# EAGLE schematic Mainboard (EAGLE 6.1)

## Sheet 1 of 5
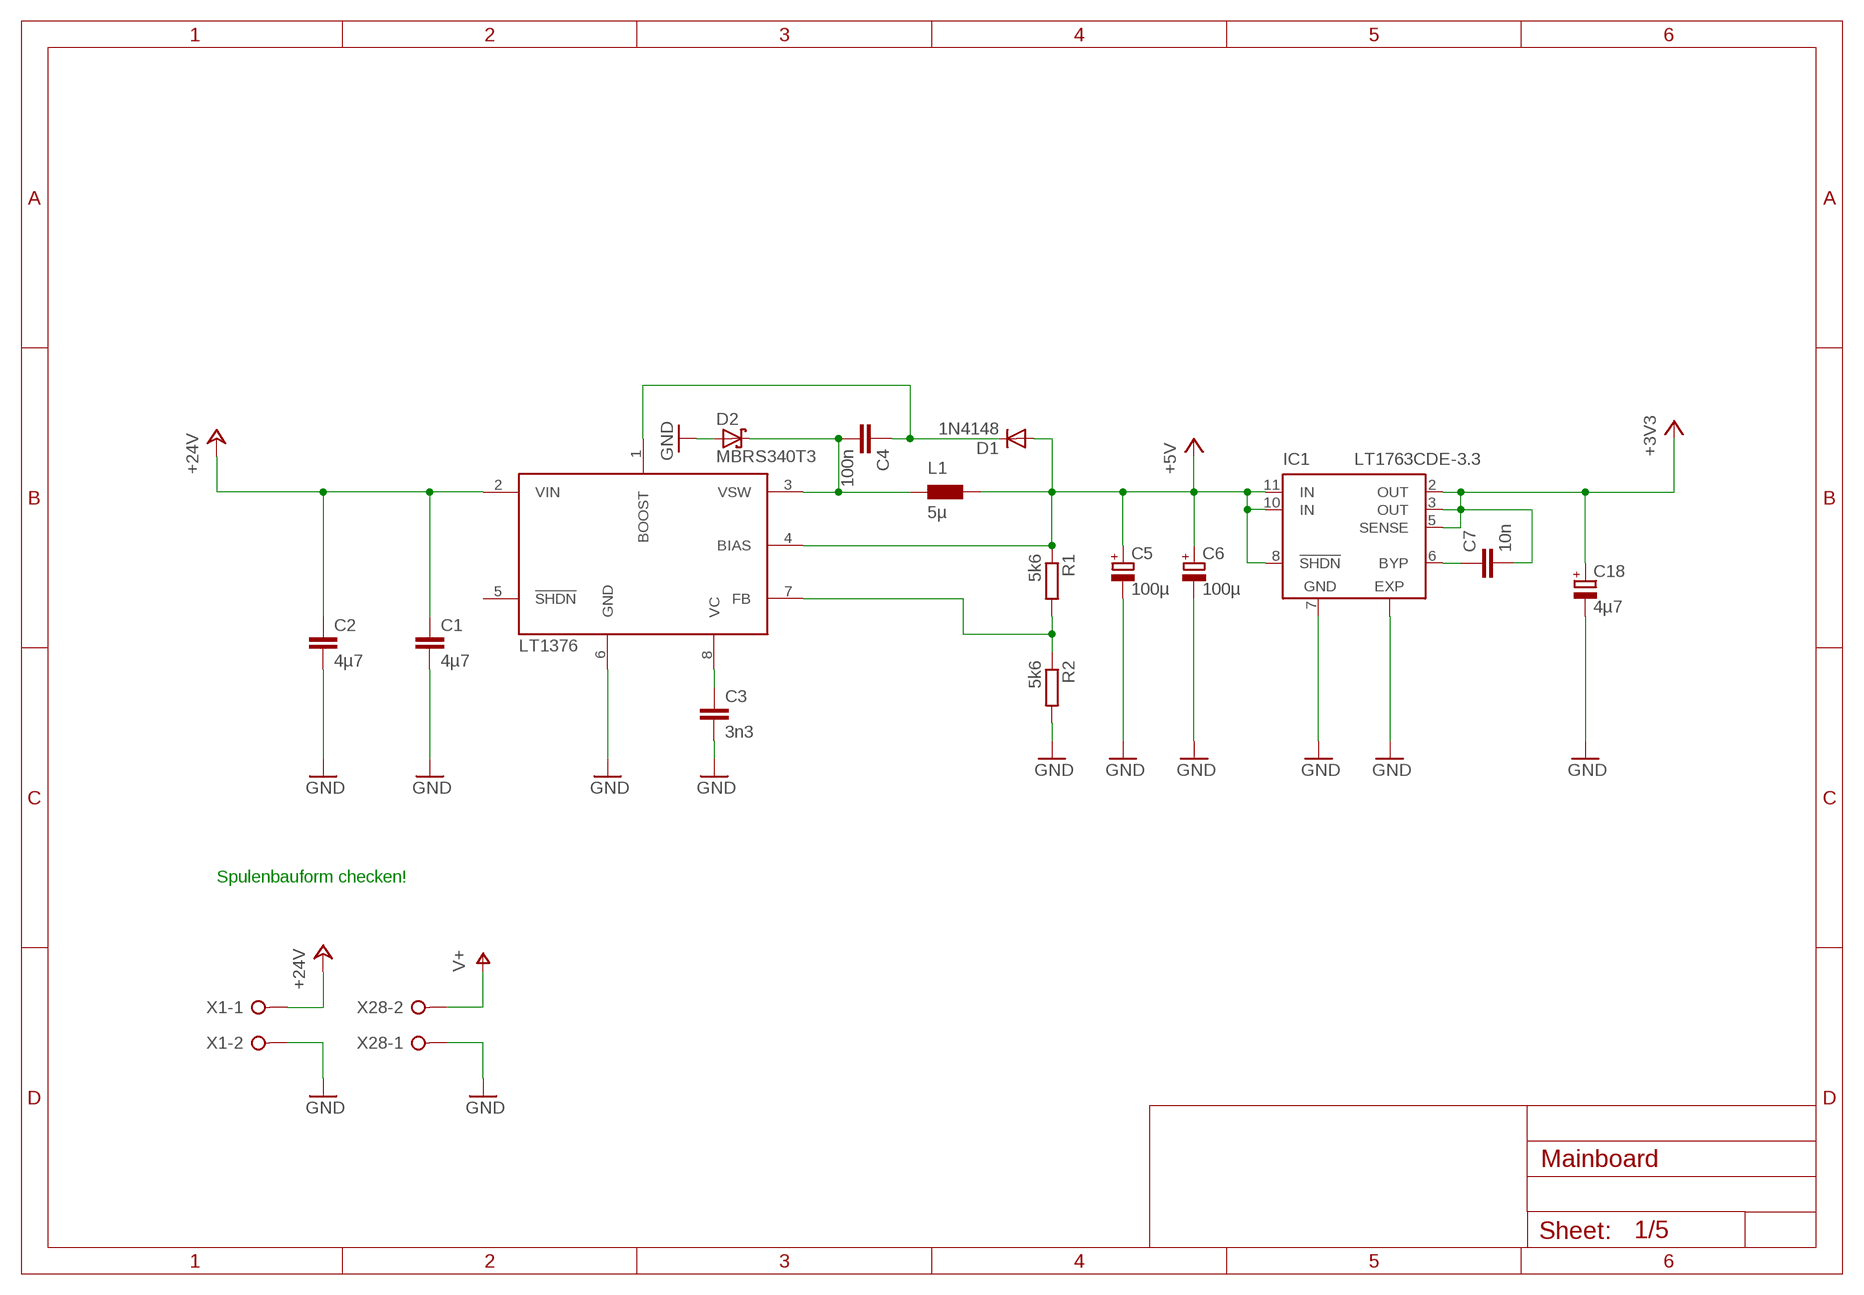
[diagram p0: schematic, sheet 1]

### Parts
C1  4µ7  C-EUC0805  [C0805]
C2  4µ7  C-EUC0805  [C0805]
C3  3n3  C-EUC0805  [C0805]
C4  100n  C-EUC0805  [C0805]
C5  100µ  CPOL-EUUD-6,3X7,7  [UD-6,3X7,7_NICHICON]
C6  100µ  CPOL-EUUD-6,3X7,7  [UD-6,3X7,7_NICHICON]
C7  10n  C-EUC0805  [C0805]
C18  4µ7  CPOL-EUUD-6,3X7,7  [UD-6,3X7,7_NICHICON]
D1  1N4148  DIODE-SOD123  [SOD123]
D2  MBRS340T3  [SMC]
IC1  LT1763CDE-3.3  [DFN12]
L1  5µ  PIS4720  [PIS4720]
R1  5k6  R-EU_R0805  [R0805]
R2  5k6  R-EU_R0805  [R0805]
U$1  LT1376  [SOIC8]
X1  W237-02P  [W237-132]
X28  W237-02P  [W237-132]

### Nets
+3V3: C7.2 C18.+ IC1.2(OUT) IC1.3(OUT) IC1.5(SENSE) ; also sheet 2,3,4,5
+5V: C5.+ C6.+ D1.A IC1.8(!SHDN) IC1.10(IN) IC1.11(IN) L1.P$2 R1.1 U$1.4(BIAS)
+24V: C1.1 C2.1 U$1.2(VIN) X1.1
GND: C1.2 C2.2 C3.2 C5.- C6.- C18.- D2.A IC1.7(GND) IC1.EXP R2.2 U$1.6(GND) X1.2 X28.1 ; also sheet 2,3,4,5
N$1: C3.1 U$1.8(VC)
N$2: C4.2 D2.C L1.P$1 U$1.3(VSW)
N$3: C4.1 D1.C U$1.1(BOOST)
N$7: R1.2 R2.1 U$1.7(FB)
N$8: C7.1 IC1.6(BYP)
V+: X28.2 ; also sheet 4
Unconnected: U$1.5(!SHDN)

### Notes on the sheet
- Spulenbauform checken!

## Sheet 2 of 5
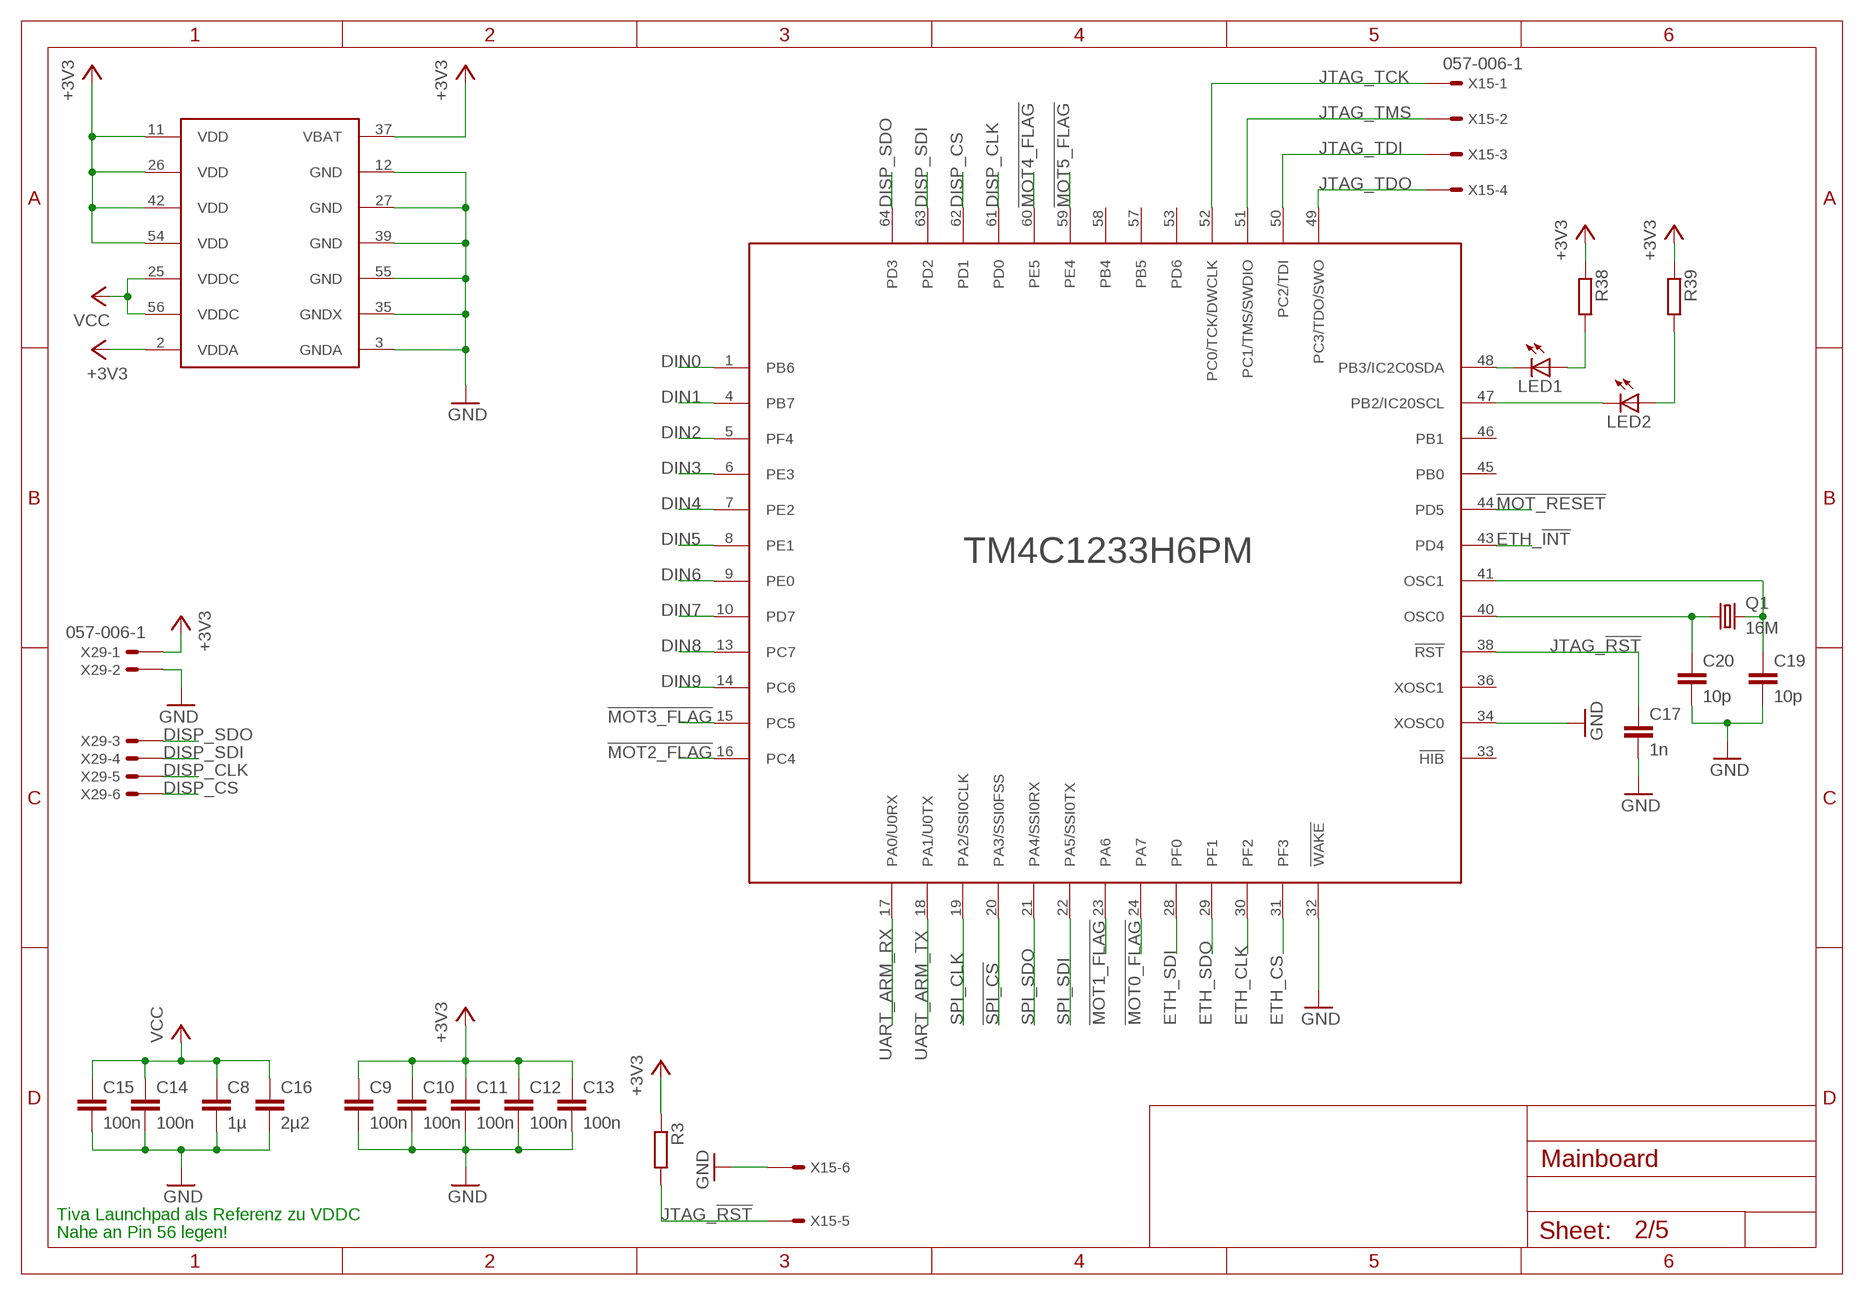
[diagram p1: schematic, sheet 2]

### Parts
C8  1µ  C-EUC0805  [C0805]
C9  100n  C-EUC0805  [C0805]
C10  100n  C-EUC0805  [C0805]
C11  100n  C-EUC0805  [C0805]
C12  100n  C-EUC0805  [C0805]
C13  100n  C-EUC0805  [C0805]
C14  100n  C-EUC0805  [C0805]
C15  100n  C-EUC0805  [C0805]
C16  2µ2  C-EUC0805  [C0805]
C17  1n  C-EUC0805  [C0805]
C19  10p  C-EUC0805  [C0805]
C20  10p  C-EUC0805  [C0805]
LED1  LEDSML0805  [SML0805]
LED2  LEDSML0805  [SML0805]
Q1  16M  CRYSTALSM49  [SM49]
R3  R-EU_R0805  [R0805]
R38  R-EU_R0805  [R0805]
R39  R-EU_R0805  [R0805]
U$2  TM4C1233H6PM  [QFP50P1200X1200X160-64N]
X15  057-006-1  [057-006-1]
X29  057-006-1  [057-006-1]

### Nets
!MOT0_FLAG: U$2.24(PA7) ; also sheet 4
!MOT1_FLAG: U$2.23(PA6) ; also sheet 4
!MOT2_FLAG: U$2.16(PC4) ; also sheet 4
!MOT3_FLAG: U$2.15(PC5) ; also sheet 4
!MOT4_FLAG: U$2.60(PE5) ; also sheet 4
!MOT5_FLAG: U$2.59(PE4) ; also sheet 4
!MOT_RESET: U$2.44(PD5) ; also sheet 4
!SPI_CS: U$2.20(PA3/SSI0FSS) ; also sheet 4
+3V3: C9.1 C10.1 C11.1 C12.1 C13.1 R3.1 R38.1 R39.1 U$2.2(VDDA) U$2.11(VDD) U$2.26(VDD) U$2.37(VBAT) U$2.42(VDD) U$2.54(VDD) X29.1 ; also sheet 1,3,4,5
DIN0: U$2.1(PB6) ; also sheet 3
DIN1: U$2.4(PB7) ; also sheet 3
DIN2: U$2.5(PF4) ; also sheet 3
DIN3: U$2.6(PE3) ; also sheet 3
DIN4: U$2.7(PE2) ; also sheet 3
DIN5: U$2.8(PE1) ; also sheet 3
DIN6: U$2.9(PE0) ; also sheet 3
DIN7: U$2.10(PD7) ; also sheet 3
DIN8: U$2.13(PC7) ; also sheet 3
DIN9: U$2.14(PC6) ; also sheet 3
DISP_CLK: U$2.61(PD0) X29.5
DISP_CS: U$2.62(PD1) X29.6
DISP_SDI: U$2.63(PD2) X29.4
DISP_SDO: U$2.64(PD3) X29.3
ETH_!INT: U$2.43(PD4) ; also sheet 5
ETH_CLK: U$2.30(PF2) ; also sheet 5
ETH_CS: U$2.31(PF3) ; also sheet 5
ETH_SDI: U$2.28(PF0) ; also sheet 5
ETH_SDO: U$2.29(PF1) ; also sheet 5
GND: C8.2 C9.2 C10.2 C11.2 C12.2 C13.2 C14.2 C15.2 C16.2 C17.2 C19.2 C20.2 U$2.3(GNDA) U$2.12(GND) U$2.27(GND) U$2.32(!WAKE) U$2.34(XOSC0) U$2.35(GNDX) U$2.39(GND) U$2.55(GND) X15.6 X29.2 ; also sheet 1,3,4,5
JTAG_!RST: C17.1 R3.2 U$2.38(!RST) X15.5
JTAG_TCK: U$2.52(PC0/TCK/DWCLK) X15.1
JTAG_TDI: U$2.50(PC2/TDI) X15.3
JTAG_TDO: U$2.49(PC3/TDO/SWO) X15.4
JTAG_TMS: U$2.51(PC1/TMS/SWDIO) X15.2
N$4: LED1.C U$2.48(PB3/IC2C0SDA)
N$5: C19.1 Q1.2 U$2.41(OSC1)
N$6: C20.1 Q1.1 U$2.40(OSC0)
N$62: LED1.A R38.2
N$66: LED2.A R39.2
N$69: LED2.C U$2.47(PB2/IC20SCL)
SPI_CLK: U$2.19(PA2/SSI0CLK) ; also sheet 4
SPI_SDI: U$2.22(PA5/SSI0TX) ; also sheet 4
SPI_SDO: U$2.21(PA4/SSI0RX) ; also sheet 4
UART_ARM_RX: U$2.17(PA0/U0RX) ; also sheet 3
UART_ARM_TX: U$2.18(PA1/U0TX) ; also sheet 3
VCC: C8.1 C14.1 C15.1 C16.1 U$2.25(VDDC) U$2.56(VDDC)
Unconnected: U$2.33(!HIB) U$2.36(XOSC1) U$2.45(PB0) U$2.46(PB1) U$2.53(PD6) U$2.57(PB5) U$2.58(PB4)

### Notes on the sheet
- Tiva Launchpad als Referenz zu VDDC
- Nahe an Pin 56 legen!

## Sheet 3 of 5
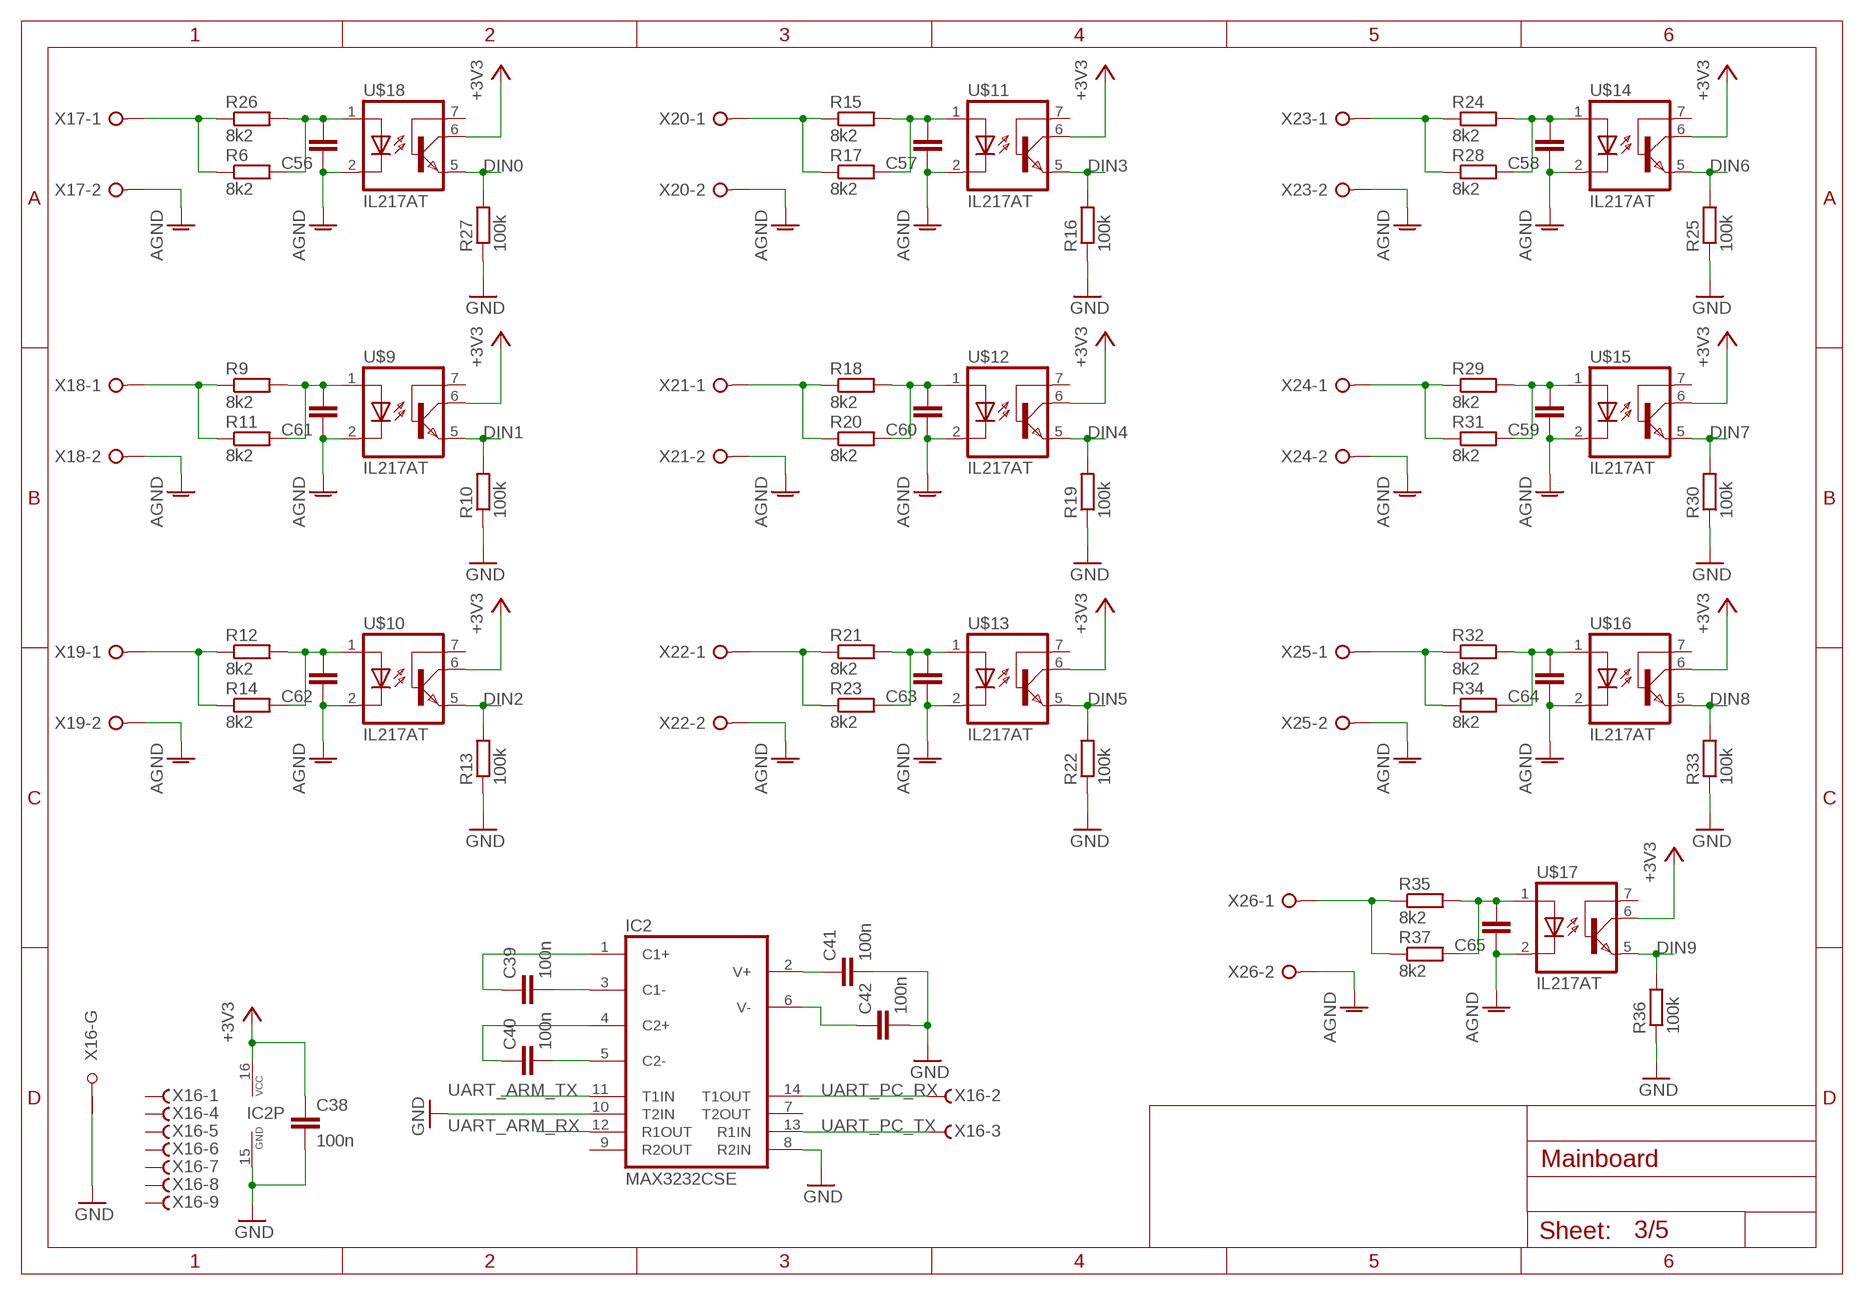
[diagram p2: schematic, sheet 3]

### Parts
C38  100n  C-EUC0805  [C0805]
C39  100n  C-EUC0805  [C0805]
C40  100n  C-EUC0805  [C0805]
C41  100n  C-EUC0805  [C0805]
C42  100n  C-EUC0805  [C0805]
C56  C-EUC1210  [C1210]
C57  C-EUC1210  [C1210]
C58  C-EUC1210  [C1210]
C59  C-EUC1210  [C1210]
C60  C-EUC1210  [C1210]
C61  C-EUC1210  [C1210]
C62  C-EUC1210  [C1210]
C63  C-EUC1210  [C1210]
C64  C-EUC1210  [C1210]
C65  C-EUC1210  [C1210]
IC2  MAX3232CSE  [SO16]
R6  8k2  R-EU_R0805  [R0805]
R9  8k2  R-EU_R0805  [R0805]
R10  100k  R-EU_R0805  [R0805]
R11  8k2  R-EU_R0805  [R0805]
R12  8k2  R-EU_R0805  [R0805]
R13  100k  R-EU_R0805  [R0805]
R14  8k2  R-EU_R0805  [R0805]
R15  8k2  R-EU_R0805  [R0805]
R16  100k  R-EU_R0805  [R0805]
R17  8k2  R-EU_R0805  [R0805]
R18  8k2  R-EU_R0805  [R0805]
R19  100k  R-EU_R0805  [R0805]
R20  8k2  R-EU_R0805  [R0805]
R21  8k2  R-EU_R0805  [R0805]
R22  100k  R-EU_R0805  [R0805]
R23  8k2  R-EU_R0805  [R0805]
R24  8k2  R-EU_R0805  [R0805]
R25  100k  R-EU_R0805  [R0805]
R26  8k2  R-EU_R0805  [R0805]
R27  100k  R-EU_R0805  [R0805]
R28  8k2  R-EU_R0805  [R0805]
R29  8k2  R-EU_R0805  [R0805]
R30  100k  R-EU_R0805  [R0805]
R31  8k2  R-EU_R0805  [R0805]
R32  8k2  R-EU_R0805  [R0805]
R33  100k  R-EU_R0805  [R0805]
R34  8k2  R-EU_R0805  [R0805]
R35  8k2  R-EU_R0805  [R0805]
R36  100k  R-EU_R0805  [R0805]
R37  8k2  R-EU_R0805  [R0805]
U$9  IL217AT  [SOIC8]
U$10  IL217AT  [SOIC8]
U$11  IL217AT  [SOIC8]
U$12  IL217AT  [SOIC8]
U$13  IL217AT  [SOIC8]
U$14  IL217AT  [SOIC8]
U$15  IL217AT  [SOIC8]
U$16  IL217AT  [SOIC8]
U$17  IL217AT  [SOIC8]
U$18  IL217AT  [SOIC8]
X16  F09HPS  [F09HP]
X17  W237-02P  [W237-132]
X18  W237-02P  [W237-132]
X19  W237-02P  [W237-132]
X20  W237-02P  [W237-132]
X21  W237-02P  [W237-132]
X22  W237-02P  [W237-132]
X23  W237-02P  [W237-132]
X24  W237-02P  [W237-132]
X25  W237-02P  [W237-132]
X26  W237-02P  [W237-132]

### Nets
+3V3: C38.1 IC2.16(VCC) U$9.6(COL) U$10.6(COL) U$11.6(COL) U$12.6(COL) U$13.6(COL) U$14.6(COL) U$15.6(COL) U$16.6(COL) U$17.6(COL) U$18.6(COL) ; also sheet 1,2,4,5
DIN0: R27.2 U$18.5(EMI) ; also sheet 2
DIN1: R10.2 U$9.5(EMI) ; also sheet 2
DIN2: R13.2 U$10.5(EMI) ; also sheet 2
DIN3: R16.2 U$11.5(EMI) ; also sheet 2
DIN4: R19.2 U$12.5(EMI) ; also sheet 2
DIN5: R22.2 U$13.5(EMI) ; also sheet 2
DIN6: R25.2 U$14.5(EMI) ; also sheet 2
DIN7: R30.2 U$15.5(EMI) ; also sheet 2
DIN8: R33.2 U$16.5(EMI) ; also sheet 2
DIN9: R36.2 U$17.5(EMI) ; also sheet 2
GND: C38.2 C41.2 C42.2 IC2.8(R2IN) IC2.10(T2IN) IC2.15(GND) R10.1 R13.1 R16.1 R19.1 R22.1 R25.1 R27.1 R30.1 R33.1 R36.1 X16.G1(-G:G1) ; also sheet 1,2,4,5
IGND: C56.1 C57.1 C58.1 C59.1 C60.1 C61.1 C62.1 C63.1 C64.1 C65.1 U$9.2(C) U$10.2(C) U$11.2(C) U$12.2(C) U$13.2(C) U$14.2(C) U$15.2(C) U$16.2(C) U$17.2(C) U$18.2(C) X17.2 X18.2 X19.2 X20.2 X21.2 X22.2 X23.2 X24.2 X25.2 X26.2 ; supply symbol labelled AGND
N$26: C40.1 IC2.4(C2+)
N$49: C39.2 IC2.3(C1-)
N$57: C42.1 IC2.6(V-)
N$58: C41.1 IC2.2(V+)
N$59: C40.2 IC2.5(C2-)
N$60: C39.1 IC2.1(C1+)
N$61: C56.2 R6.2 R26.2 U$18.1(A)
N$63: R6.1 R26.1 X17.1
N$64: R9.1 R11.1 X18.1
N$65: C61.2 R9.2 R11.2 U$9.1(A)
N$67: R12.1 R14.1 X19.1
N$68: C62.2 R12.2 R14.2 U$10.1(A)
N$70: R15.1 R17.1 X20.1
N$71: C57.2 R15.2 R17.2 U$11.1(A)
N$73: R18.1 R20.1 X21.1
N$74: C60.2 R18.2 R20.2 U$12.1(A)
N$76: R21.1 R23.1 X22.1
N$77: C63.2 R21.2 R23.2 U$13.1(A)
N$79: R24.1 R28.1 X23.1
N$80: C58.2 R24.2 R28.2 U$14.1(A)
N$82: R29.1 R31.1 X24.1
N$83: C59.2 R29.2 R31.2 U$15.1(A)
N$85: R32.1 R34.1 X25.1
N$86: C64.2 R32.2 R34.2 U$16.1(A)
N$88: R35.1 R37.1 X26.1
N$89: C65.2 R35.2 R37.2 U$17.1(A)
UART_ARM_RX: IC2.12(R1OUT) ; also sheet 2
UART_ARM_TX: IC2.11(T1IN) ; also sheet 2
UART_PC_RX: IC2.14(T1OUT) X16.2(-2:F)
UART_PC_TX: IC2.13(R1IN) X16.3(-3:F)
Unconnected: IC2.7(T2OUT) IC2.9(R2OUT) U$9.7(BAS) U$10.7(BAS) U$11.7(BAS) U$12.7(BAS) U$13.7(BAS) U$14.7(BAS) U$15.7(BAS) U$16.7(BAS) U$17.7(BAS) U$18.7(BAS) X16.1(-1:F) X16.4(-4:F) X16.5(-5:F) X16.6(-6:F) X16.7(-7:F) X16.8(-8:F) X16.9(-9:F) X16.G2(-G:G2)

## Sheet 4 of 5
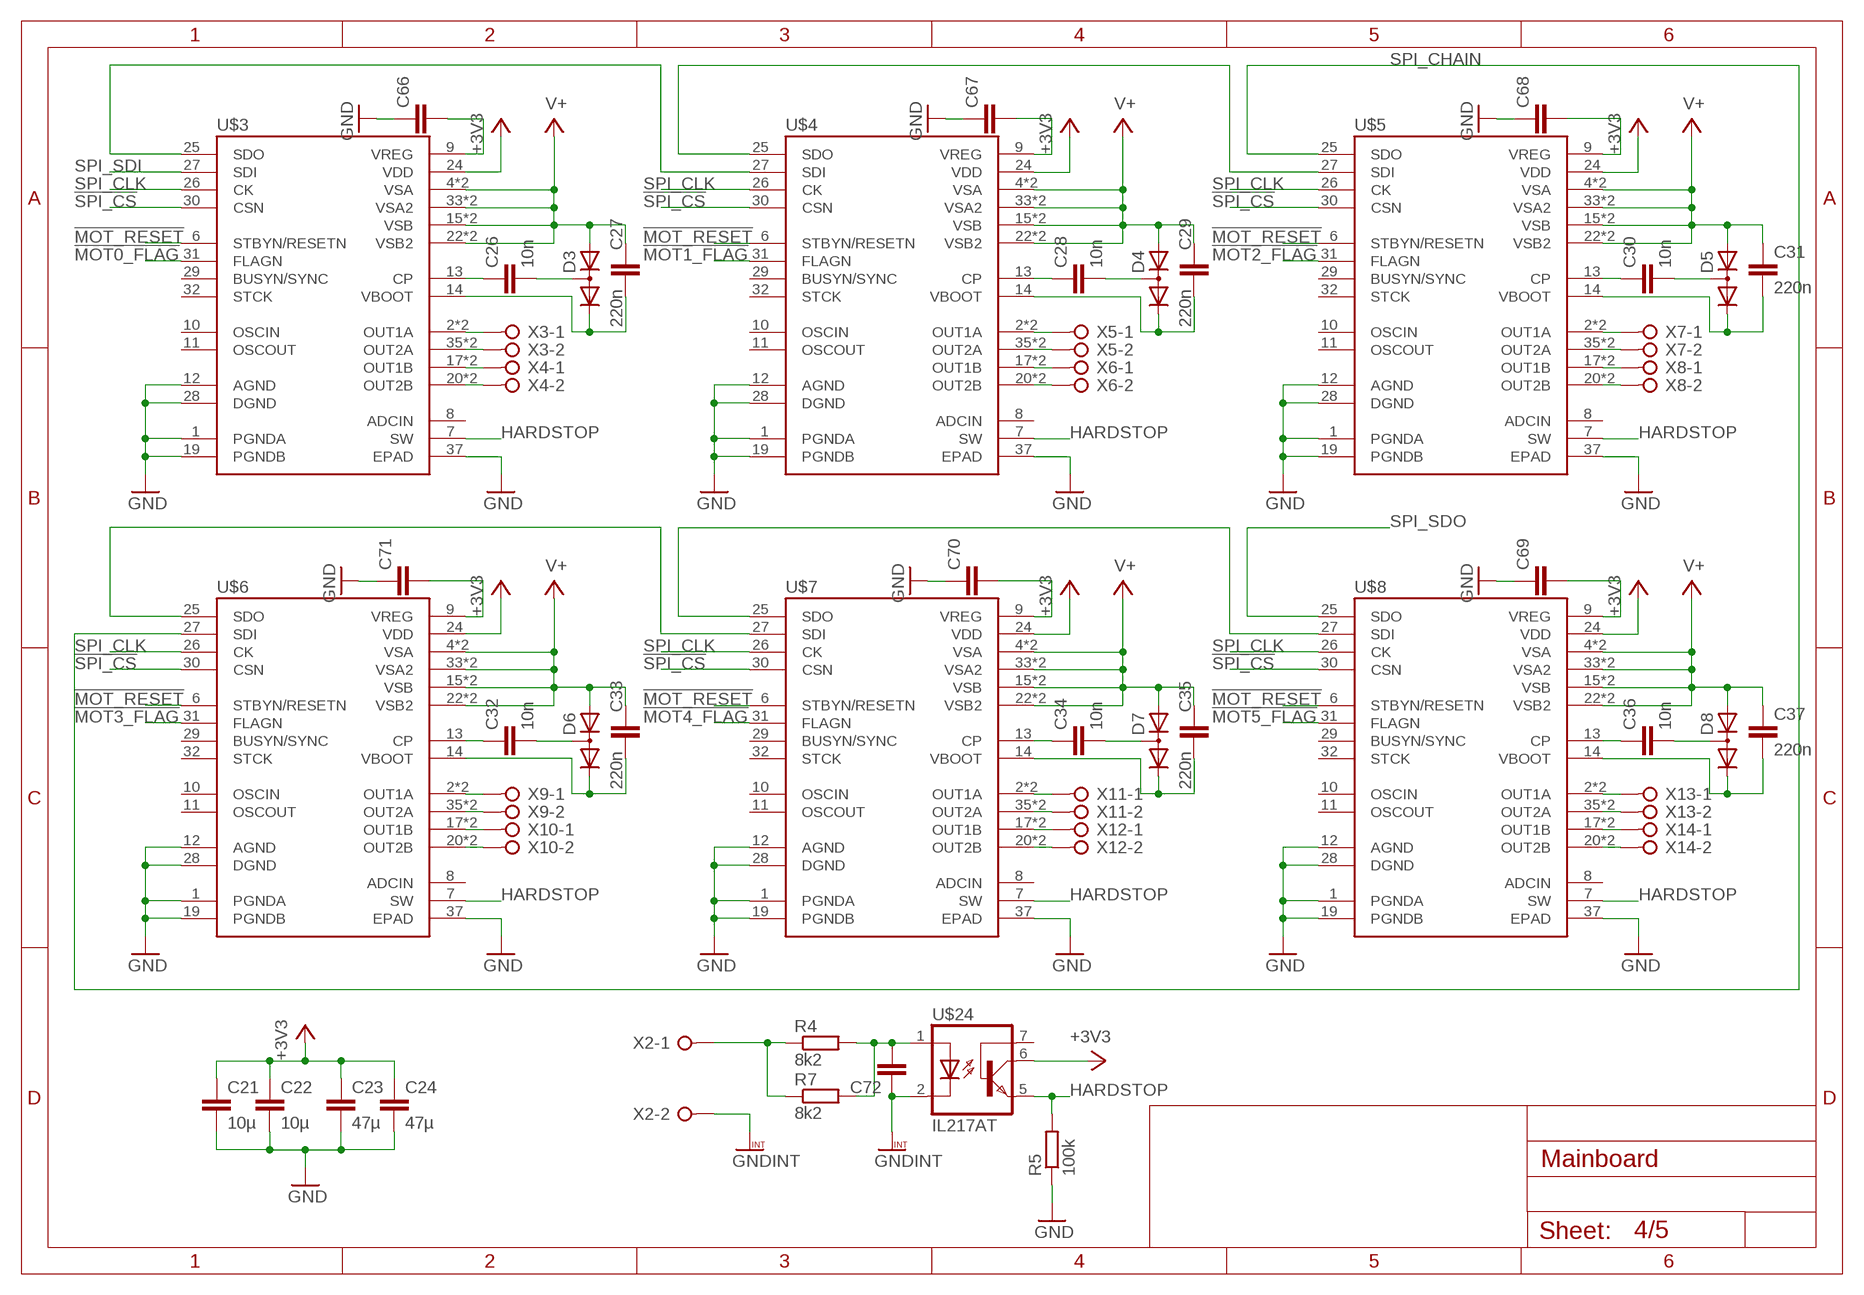
[diagram p3: schematic, sheet 4]

### Parts
C21  10µ  C-EUC0805  [C0805]
C22  10µ  C-EUC0805  [C0805]
C23  47µ  C-EUC0805  [C0805]
C24  47µ  C-EUC0805  [C0805]
C26  10n  C-EUC0805  [C0805]
C27  220n  C-EUC0805  [C0805]
C28  10n  C-EUC0805  [C0805]
C29  220n  C-EUC0805  [C0805]
C30  10n  C-EUC0805  [C0805]
C31  220n  C-EUC0805  [C0805]
C32  10n  C-EUC0805  [C0805]
C33  220n  C-EUC0805  [C0805]
C34  10n  C-EUC0805  [C0805]
C35  220n  C-EUC0805  [C0805]
C36  10n  C-EUC0805  [C0805]
C37  220n  C-EUC0805  [C0805]
C66  C-EUC1210  [C1210]
C67  C-EUC1210  [C1210]
C68  C-EUC1210  [C1210]
C69  C-EUC1210  [C1210]
C70  C-EUC1210  [C1210]
C71  C-EUC1210  [C1210]
C72  C-EUC1210  [C1210]
D3  HSMS-2802-TR1G  DIODE_2CACA-SOT23  [SOT23]
D4  HSMS-2802-TR1G  DIODE_2CACA-SOT23  [SOT23]
D5  HSMS-2802-TR1G  DIODE_2CACA-SOT23  [SOT23]
D6  HSMS-2802-TR1G  DIODE_2CACA-SOT23  [SOT23]
D7  HSMS-2802-TR1G  DIODE_2CACA-SOT23  [SOT23]
D8  HSMS-2802-TR1G  DIODE_2CACA-SOT23  [SOT23]
R4  8k2  R-EU_R0805  [R0805]
R5  100k  R-EU_R0805  [R0805]
R7  8k2  R-EU_R0805  [R0805]
U$3  L6470HPOWERSO36  [SOP65P1400X360-37N]
U$4  L6470HPOWERSO36  [SOP65P1400X360-37N]
U$5  L6470HPOWERSO36  [SOP65P1400X360-37N]
U$6  L6470HPOWERSO36  [SOP65P1400X360-37N]
U$7  L6470HPOWERSO36  [SOP65P1400X360-37N]
U$8  L6470HPOWERSO36  [SOP65P1400X360-37N]
U$24  IL217AT  [SOIC8]
X2  W237-02P  [W237-132]
X3  W237-02P  [W237-132]
X4  W237-02P  [W237-132]
X5  W237-02P  [W237-132]
X6  W237-02P  [W237-132]
X7  W237-02P  [W237-132]
X8  W237-02P  [W237-132]
X9  W237-02P  [W237-132]
X10  W237-02P  [W237-132]
X11  W237-02P  [W237-132]
X12  W237-02P  [W237-132]
X13  W237-02P  [W237-132]
X14  W237-02P  [W237-132]

### Nets
!MOT0_FLAG: U$3.31(FLAGN) ; also sheet 2
!MOT1_FLAG: U$4.31(FLAGN) ; also sheet 2
!MOT2_FLAG: U$5.31(FLAGN) ; also sheet 2
!MOT3_FLAG: U$6.31(FLAGN) ; also sheet 2
!MOT4_FLAG: U$7.31(FLAGN) ; also sheet 2
!MOT5_FLAG: U$8.31(FLAGN) ; also sheet 2
!MOT_RESET: U$3.6(STBYN/RESETN) U$4.6(STBYN/RESETN) U$5.6(STBYN/RESETN) U$6.6(STBYN/RESETN) U$7.6(STBYN/RESETN) U$8.6(STBYN/RESETN) ; also sheet 2
!SPI_CS: U$3.30(CSN) U$4.30(CSN) U$5.30(CSN) U$6.30(CSN) U$7.30(CSN) U$8.30(CSN) ; also sheet 2
+3V3: C21.1 C22.1 C23.1 C24.1 U$3.24(VDD) U$4.24(VDD) U$5.24(VDD) U$6.24(VDD) U$7.24(VDD) U$8.24(VDD) U$24.6(COL) ; also sheet 1,2,3,5
GND: C21.2 C22.2 C23.2 C24.2 C66.1 C67.1 C68.1 C69.1 C70.1 C71.1 R5.1 U$3.1(PGNDA) U$3.12(AGND) U$3.19(PGNDB) U$3.28(DGND) U$3.37(EPAD) U$4.1(PGNDA) U$4.12(AGND) U$4.19(PGNDB) U$4.28(DGND) U$4.37(EPAD) U$5.1(PGNDA) U$5.12(AGND) U$5.19(PGNDB) U$5.28(DGND) U$5.37(EPAD) U$6.1(PGNDA) U$6.12(AGND) U$6.19(PGNDB) U$6.28(DGND) U$6.37(EPAD) U$7.1(PGNDA) U$7.12(AGND) U$7.19(PGNDB) U$7.28(DGND) U$7.37(EPAD) U$8.1(PGNDA) U$8.12(AGND) U$8.19(PGNDB) U$8.28(DGND) U$8.37(EPAD) ; also sheet 1,2,3,5
GND@5: R4.1 R7.1 X2.1
GNDINT: C72.1 U$24.2(C) X2.2
HARDSTOP: R5.2 U$3.7(SW) U$4.7(SW) U$5.7(SW) U$6.7(SW) U$7.7(SW) U$8.7(SW) U$24.5(EMI)
N$9: U$3.25(SDO) U$4.27(SDI)
N$10: U$6.25(SDO) U$7.27(SDI)
N$11: C26.1 U$3.13(CP)
N$12: C27.2 D3.2(C) U$3.14(VBOOT)
N$13: C26.2 D3.3(AC)
N$14: C28.1 U$4.13(CP)
N$15: C29.2 D4.2(C) U$4.14(VBOOT)
N$16: U$4.25(SDO) U$5.27(SDI)
N$17: C28.2 D4.3(AC)
N$18: U$3.2(OUT1A) U$3.3(OUT1A) X3.1
N$19: U$3.35(OUT2A) U$3.36(OUT2A) X3.2
N$20: U$3.17(OUT1B) U$3.18(OUT1B) X4.1
N$21: U$3.20(OUT2B) U$3.21(OUT2B) X4.2
N$22: U$4.2(OUT1A) U$4.3(OUT1A) X5.1
N$23: U$4.35(OUT2A) U$4.36(OUT2A) X5.2
N$24: U$4.17(OUT1B) U$4.18(OUT1B) X6.1
N$25: U$4.20(OUT2B) U$4.21(OUT2B) X6.2
N$27: C31.2 D5.2(C) U$5.14(VBOOT)
N$28: C30.2 D5.3(AC)
N$29: C30.1 U$5.13(CP)
N$30: U$5.2(OUT1A) U$5.3(OUT1A) X7.1
N$31: U$5.35(OUT2A) U$5.36(OUT2A) X7.2
N$32: U$5.17(OUT1B) U$5.18(OUT1B) X8.1
N$33: U$5.20(OUT2B) U$5.21(OUT2B) X8.2
N$34: U$7.25(SDO) U$8.27(SDI)
N$35: C32.1 U$6.13(CP)
N$36: C33.2 D6.2(C) U$6.14(VBOOT)
N$37: C32.2 D6.3(AC)
N$38: C35.2 D7.2(C) U$7.14(VBOOT)
N$39: C34.2 D7.3(AC)
N$40: C34.1 U$7.13(CP)
N$41: U$6.2(OUT1A) U$6.3(OUT1A) X9.1
N$42: U$6.35(OUT2A) U$6.36(OUT2A) X9.2
N$43: U$6.17(OUT1B) U$6.18(OUT1B) X10.1
N$44: U$6.20(OUT2B) U$6.21(OUT2B) X10.2
N$45: U$7.2(OUT1A) U$7.3(OUT1A) X11.1
N$46: U$7.35(OUT2A) U$7.36(OUT2A) X11.2
N$47: U$7.17(OUT1B) U$7.18(OUT1B) X12.1
N$48: U$7.20(OUT2B) U$7.21(OUT2B) X12.2
N$50: C37.2 D8.2(C) U$8.14(VBOOT)
N$51: C36.2 D8.3(AC)
N$52: C36.1 U$8.13(CP)
N$53: U$8.2(OUT1A) U$8.3(OUT1A) X13.1
N$54: U$8.35(OUT2A) U$8.36(OUT2A) X13.2
N$55: U$8.17(OUT1B) U$8.18(OUT1B) X14.1
N$56: U$8.20(OUT2B) U$8.21(OUT2B) X14.2
N$103: C66.2 U$3.9(VREG)
N$105: C67.2 U$4.9(VREG)
N$106: C68.2 U$5.9(VREG)
N$107: C69.2 U$8.9(VREG)
N$108: C70.2 U$7.9(VREG)
N$109: C71.2 U$6.9(VREG)
N$110: C72.2 R4.2 R7.2 U$24.1(A)
SPI_CHAIN: U$5.25(SDO) U$6.27(SDI)
SPI_CLK: U$3.26(CK) U$4.26(CK) U$5.26(CK) U$6.26(CK) U$7.26(CK) U$8.26(CK) ; also sheet 2
SPI_SDI: U$3.27(SDI) ; also sheet 2
SPI_SDO: U$8.25(SDO) ; also sheet 2
V+: C27.1 C29.1 C31.1 C33.1 C35.1 C37.1 D3.1(A) D4.1(A) D5.1(A) D6.1(A) D7.1(A) D8.1(A) U$3.4(VSA) U$3.5(VSA) U$3.15(VSB) U$3.16(VSB) U$3.22(VSB2) U$3.23(VSB2) U$3.33(VSA2) U$3.34(VSA2) U$4.4(VSA) U$4.5(VSA) U$4.15(VSB) U$4.16(VSB) U$4.22(VSB2) U$4.23(VSB2) U$4.33(VSA2) U$4.34(VSA2) U$5.4(VSA) U$5.5(VSA) U$5.15(VSB) U$5.16(VSB) U$5.22(VSB2) U$5.23(VSB2) U$5.33(VSA2) U$5.34(VSA2) U$6.4(VSA) U$6.5(VSA) U$6.15(VSB) U$6.16(VSB) U$6.22(VSB2) U$6.23(VSB2) U$6.33(VSA2) U$6.34(VSA2) U$7.4(VSA) U$7.5(VSA) U$7.15(VSB) U$7.16(VSB) U$7.22(VSB2) U$7.23(VSB2) U$7.33(VSA2) U$7.34(VSA2) U$8.4(VSA) U$8.5(VSA) U$8.15(VSB) U$8.16(VSB) U$8.22(VSB2) U$8.23(VSB2) U$8.33(VSA2) U$8.34(VSA2) ; also sheet 1
Unconnected: U$3.8(ADCIN) U$3.10(OSCIN) U$3.11(OSCOUT) U$3.29(BUSYN/SYNC) U$3.32(STCK) U$4.8(ADCIN) U$4.10(OSCIN) U$4.11(OSCOUT) U$4.29(BUSYN/SYNC) U$4.32(STCK) U$5.8(ADCIN) U$5.10(OSCIN) U$5.11(OSCOUT) U$5.29(BUSYN/SYNC) U$5.32(STCK) U$6.8(ADCIN) U$6.10(OSCIN) U$6.11(OSCOUT) U$6.29(BUSYN/SYNC) U$6.32(STCK) U$7.8(ADCIN) U$7.10(OSCIN) U$7.11(OSCOUT) U$7.29(BUSYN/SYNC) U$7.32(STCK) U$8.8(ADCIN) U$8.10(OSCIN) U$8.11(OSCOUT) U$8.29(BUSYN/SYNC) U$8.32(STCK) U$24.7(BAS)

## Sheet 5 of 5
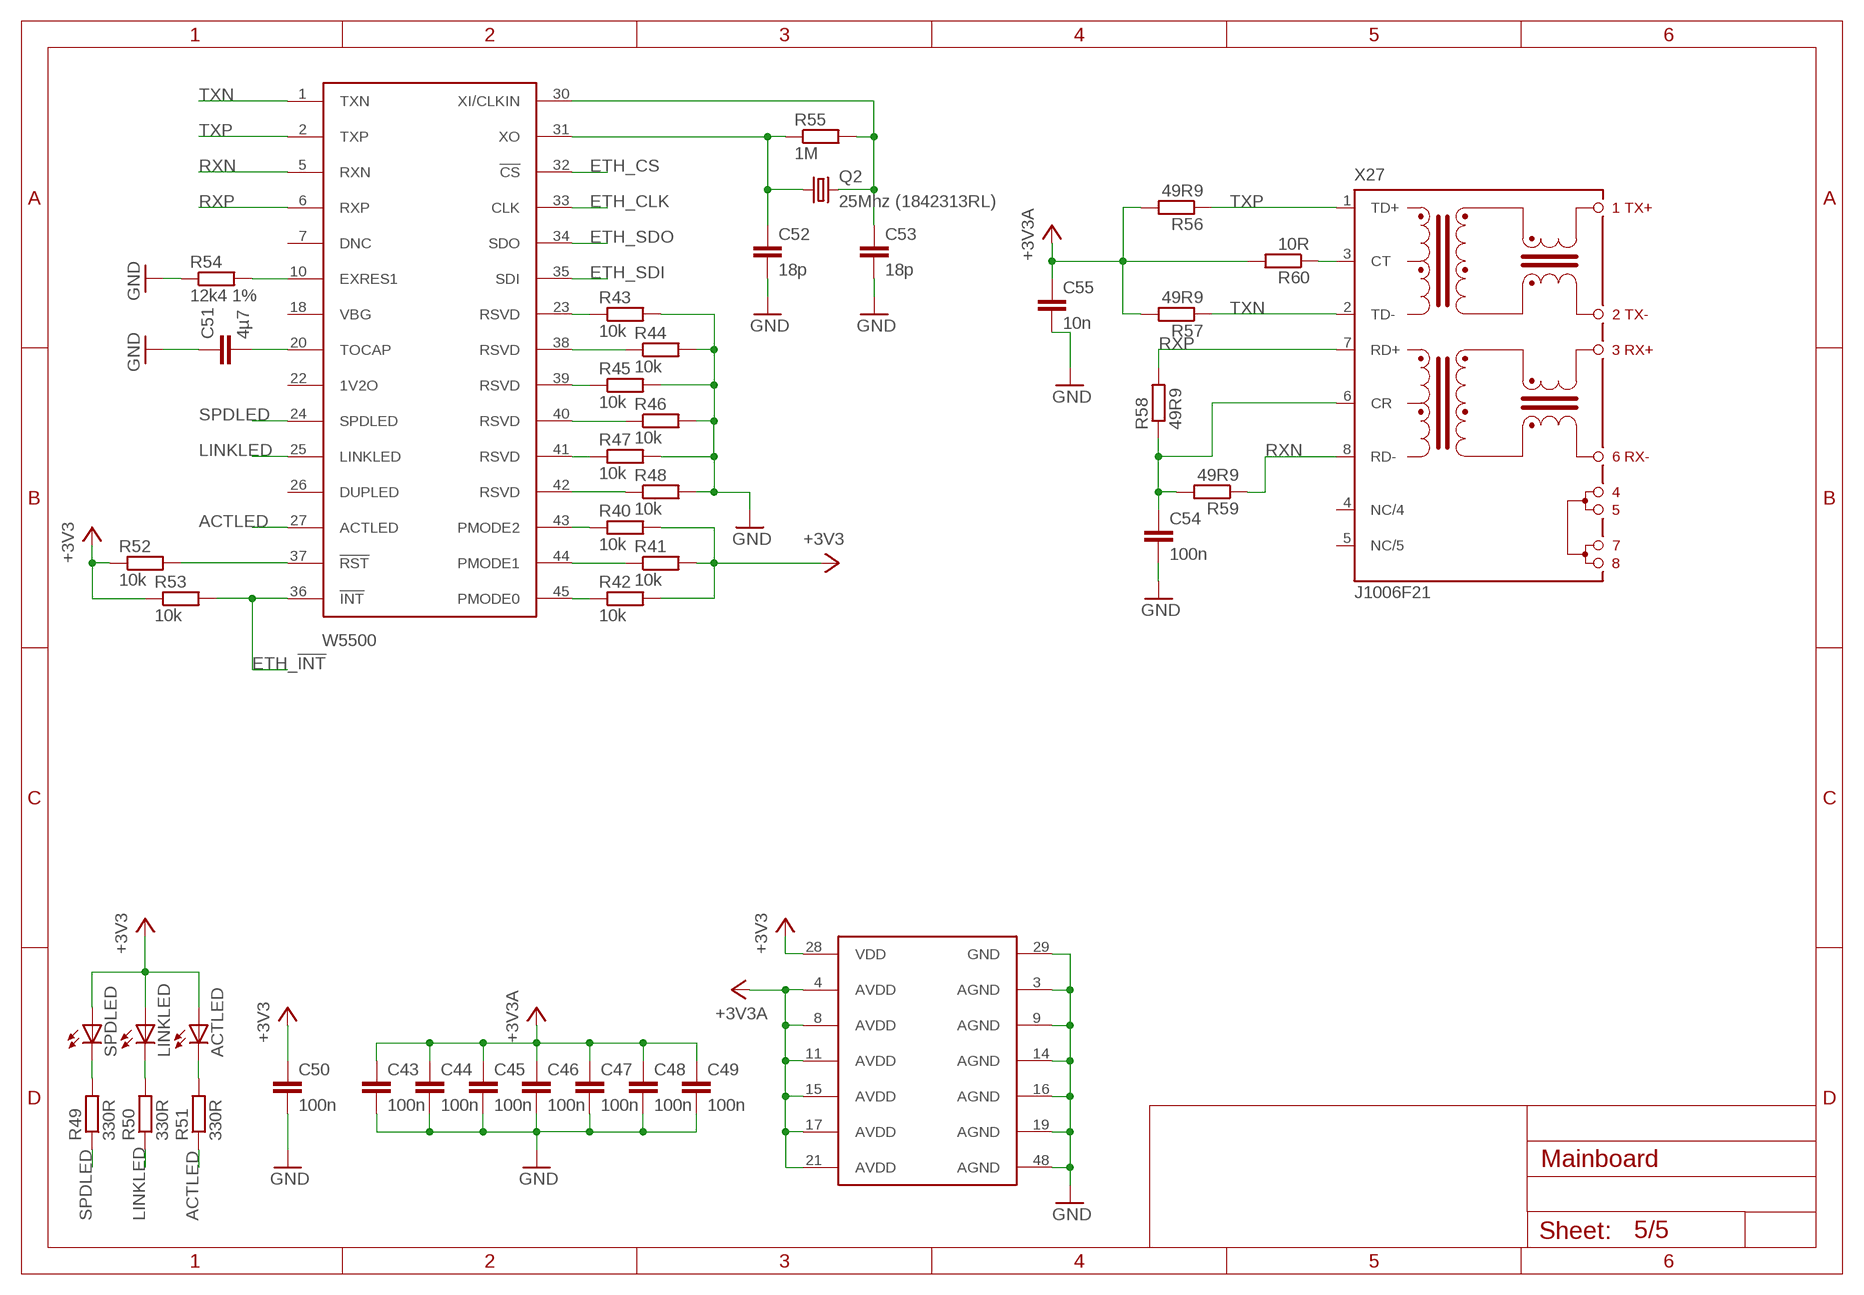
[diagram p4: schematic, sheet 5]

### Parts
ACTLED  LEDCHIPLED_0805  [CHIPLED_0805]
C43  100n  C-EUC0805  [C0805]
C44  100n  C-EUC0805  [C0805]
C45  100n  C-EUC0805  [C0805]
C46  100n  C-EUC0805  [C0805]
C47  100n  C-EUC0805  [C0805]
C48  100n  C-EUC0805  [C0805]
C49  100n  C-EUC0805  [C0805]
C50  100n  C-EUC0805  [C0805]
C51  4µ7  C-EUC0805  [C0805]
C52  18p  C-EUC0805  [C0805]
C53  18p  C-EUC0805  [C0805]
C54  100n  C-EUC0805  [C0805]
C55  10n  C-EUC0805  [C0805]
LINKLED  LEDCHIPLED_0805  [CHIPLED_0805]
Q2  25Mhz (1842313RL)  CRYSTALHC49UP  [HC49UP]
R40  10k  R-EU_R0805  [R0805]
R41  10k  R-EU_R0805  [R0805]
R42  10k  R-EU_R0805  [R0805]
R43  10k  R-EU_R0805  [R0805]
R44  10k  R-EU_R0805  [R0805]
R45  10k  R-EU_R0805  [R0805]
R46  10k  R-EU_R0805  [R0805]
R47  10k  R-EU_R0805  [R0805]
R48  10k  R-EU_R0805  [R0805]
R49  330R  R-EU_R0805  [R0805]
R50  330R  R-EU_R0805  [R0805]
R51  330R  R-EU_R0805  [R0805]
R52  10k  R-EU_R0805  [R0805]
R53  10k  R-EU_R0805  [R0805]
R54  12k4 1%  R-EU_R0805  [R0805]
R55  1M  R-EU_R0805  [R0805]
R56  49R9  R-EU_R0805  [R0805]
R57  49R9  R-EU_R0805  [R0805]
R58  49R9  R-EU_R0805  [R0805]
R59  49R9  R-EU_R0805  [R0805]
R60  10R  R-EU_R0805  [R0805]
SPDLED  LEDCHIPLED_0805  [CHIPLED_0805]
U$19  W5500  [LQFP48]
X27  J1006F21  [J1]

### Nets
+3V3: ACTLED.A C43.1 C44.1 C45.1 C46.1 C47.1 C48.1 C49.1 C50.1 C55.1 LINKLED.A R40.2 R41.2 R42.2 R52.1 R53.1 R56.2 R57.2 R60.2 SPDLED.A U$19.4(AVDD) U$19.8(AVDD) U$19.11(AVDD) U$19.15(AVDD) U$19.17(AVDD) U$19.21(AVDD) U$19.28(VDD) ; supply symbol labelled +3V3A ; also sheet 1,2,3,4
ACTLED: R51.1 U$19.27(ACTLED)
ETH_!INT: R53.2 U$19.36(!INT) ; also sheet 2
ETH_CLK: U$19.33(CLK) ; also sheet 2
ETH_CS: U$19.32(!CS) ; also sheet 2
ETH_SDI: U$19.35(SDI) ; also sheet 2
ETH_SDO: U$19.34(SDO) ; also sheet 2
GND: C43.2 C44.2 C45.2 C46.2 C47.2 C48.2 C49.2 C50.2 C51.1 C52.2 C53.2 C54.2 C55.2 R43.2 R44.2 R45.2 R46.2 R47.2 R48.2 R54.1 U$19.3(AGND) U$19.9(AGND) U$19.14(AGND) U$19.16(AGND) U$19.19(AGND) U$19.29(GND) U$19.48(AGND) ; also sheet 1,2,3,4
LINKLED: R50.1 U$19.25(LINKLED)
N$72: R43.1 U$19.23(RSVD)
N$75: R44.1 U$19.38(RSVD)
N$78: R45.1 U$19.39(RSVD)
N$81: R46.1 U$19.40(RSVD)
N$84: R40.1 U$19.43(PMODE2)
N$87: R41.1 U$19.44(PMODE1)
N$90: R42.1 U$19.45(PMODE0)
N$91: R47.1 U$19.41(RSVD)
N$92: R48.1 U$19.42(RSVD)
N$93: R52.2 U$19.37(!RST)
N$94: R49.2 SPDLED.C
N$95: LINKLED.C R50.2
N$96: ACTLED.C R51.2
N$97: R54.2 U$19.10(EXRES1)
N$98: C51.2 U$19.20(TOCAP)
N$99: C53.1 Q2.2 R55.2 U$19.30(XI/CLKIN)
N$100: C52.1 Q2.1 R55.1 U$19.31(XO)
N$101: C54.1 R58.1 R59.2 X27.6(CR)
N$104: R60.1 X27.3(CT)
RXN: R59.1 U$19.5(RXN) X27.8(RD-)
RXP: R58.2 U$19.6(RXP) X27.7(RD+)
SPDLED: R49.1 U$19.24(SPDLED)
TXN: R57.1 U$19.1(TXN) X27.2(TD-)
TXP: R56.1 U$19.2(TXP) X27.1(TD+)
Unconnected: U$19.7(DNC) U$19.18(VBG) U$19.22(1V2O) U$19.26(DUPLED) X27.4(NC/4) X27.5(NC/5)

## Library data of the parts
ACTLED LED1 LED2 LINKLED SPDLED = led:LED: LED OSRAM: - CHIPLED LG R971, LG N971, LY N971, LG Q971, LY Q971, LO R971, LY R971 LH N974, LH R974 LS Q976, LO Q976, LY Q976 LO Q996 - Hyper CHIPLED LW Q18S LB Q993, LB Q99A, LB R99A - SideLED LS A670, LO A670, LY A670, LG A670, LP A670 LB A673, LV A673, LT A673, LW A673 LH A674 LY A675 LS A676, LA A676, LO A676, LY A676, LW A676 LS A679, LY A679, LG A679 - Hyper Micro SIDELED® LS Y876, LA Y876, LO Y876, LY Y876 LT Y87S - SmartLED LW L88C, LW L88S LB L89C, LB L89S, LG L890 LS L89K, LO L89K, LY L89K LS L896, LA L896, LO L896, LY L896 - TOPLED LS T670, LO T670, LY T670, LG T670, LP T670 LSG T670, LSP T670, LSY T670, LOP T670, LYG T670 LG T671, LOG T671, LSG T671 LB T673, LV T673, LT T673, LW T673 LH T674 LS T676, LA T676, LO T676, LY T676, LB T676, LH T676, LSB T676, LW T676 LB T67C, LV T67C, LT T67C, LS T67K, LO T67K, LY T67K, LW E67C LS E67B, LA E67B, LO E67B, LY E67B, LB E67C, LV E67C, LT E67C LW T67C LS T679, LY T679, LG T679 LS T770, LO T770, LY T770, LG T770, LP T770 LB T773, LV T773, LT T773, LW T773 LH T774 LS E675, LA E675, LY E675, LS T675 LS T776, LA T776, LO T776, LY T776, LB T776 LHGB T686 LT T68C, LB T68C - Hyper Mini TOPLED® LB M676 - Mini TOPLED Santana® LG M470 LS M47K, LO M47K, LY M47K Source: http://www.osram.convergy.de LUXEON: - LUMILED® LXK2-PW12-R00, LXK2-PW12-S00, LXK2-PW14-U00, LXK2-PW14-V00 LXK2-PM12-R00, LXK2-PM12-S00, LXK2-PM14-U00 LXK2-PE12-Q00, LXK2-PE12-R00, LXK2-PE12-S00, LXK2-PE14-T00, LXK2-PE14-U00 LXK2-PB12-K00, LXK2-PB12-L00, LXK2-PB12-M00, LXK2-PB14-N00, LXK2-PB14-P00, LXK2-PB14-Q00 LXK2-PR12-L00, LXK2-PR12-M00, LXK2-PR14-Q00, LXK2-PR14-R00 LXK2-PD12-Q00, LXK2-PD12-R00, LXK2-PD12-S00 LXK2-PH12-R00, LXK2-PH12-S00 LXK2-PL12-P00, LXK2-PL12-Q00, LXK2-PL12-R00 Source: www.luxeon.com KINGBRIGHT: KA-3528ASYC Source: www.kingbright.com
C1-C4 C7-C17 C19-C24 C26-C72 = rcl:C-EU: CAPACITOR, European symbol
C5 C6 C18 = rcl:CPOL-EU: POLARIZED CAPACITOR, European symbol
D1 = diode:DIODE-: DIODE
D2 = diode:MBRS3*0T3: SCHOTTKY BARRIER RECTIFIER 3.0 AMPERES 20, 30, 40 VOLT Source: MBRS340T3-D.pdf
D3-D8 = diode:DIODE_2CACA-: 2 Diodes - Cathode-Anode|Cathode-Anode
IC1 = linear-technology:LT1763: 500mA, Low Noise, LDO Micropower Regulators Source: http://cds.linear.com/docs/Datasheet/1763ff.pdf; MPN: LT1763CDE-3.3; OC_FARNELL: unknown; OC_NEWARK: 57M6028
IC2 = maxim:MAX3232*: True RS-232 Transceivers 3.0V to 5.5V, Low-Power up to 1Mbps, Using Four 0.1µF External Capacitors Source: http://pdfserv.maxim-ic.com/en/ds/MAX3222-MAX3241.pdf; MPN: MAX3232CSE; OC_FARNELL: 9725490; OC_NEWARK: 90C2890
L1 = inductor-fastron:PIS4720: Fastron SMD Power Inductors Source: http://www.fastrongroup.com/series/52/findProducts
Q1 Q2 = crystal:CRYSTAL: CRYSTAL; OC_FARNELL: unknown; OC_NEWARK: unknown
R1-R7 R9-R60 = rcl:R-EU_: RESISTOR, European symbol
U$1 = Hardware:LT1376
U$2 = Hardware:TM4C1233H6PM
U$3-U$8 = Hardware:L6470H
U$9-U$18 U$24 = Hardware:IL217AT
U$19 = Hardware:W5500
X1-X14 X17-X26 X28 = con-wago-508:W237-02P: WAGO SREW CLAMP; OC_FARNELL: unknown; OC_NEWARK: unknown
X15 X29 = con-panduit:057-006-: CONNECTOR 6-pin series 057 contact pc board low profile headers; OC_FARNELL: unknown; OC_NEWARK: unknown
X16 = con-subd:F09HPS: SUB-D; OC_FARNELL: unknown; OC_NEWARK: unknown
X27 = con-pulse:J1006F21: PULSEJACK (TM) 1x1 Tab-UP RJ45 10/100 Base-TX RJ45 1x1 Tab-UP with LEDs 8-pin (J1 series) and 6-pin (JP series) integrated magnetics connector, designed to support applications, such as ADSL modems, LAN-on-Motherboard, and Hub and Switches. Source: www.pulseeng.com .. PulseJack-J402.pdf; OC_FARNELL: unknown; OC_NEWARK: unknown